# EasyEDA schematic 9833YUANLI.json
REV: 1.0; Sheet: 1/1
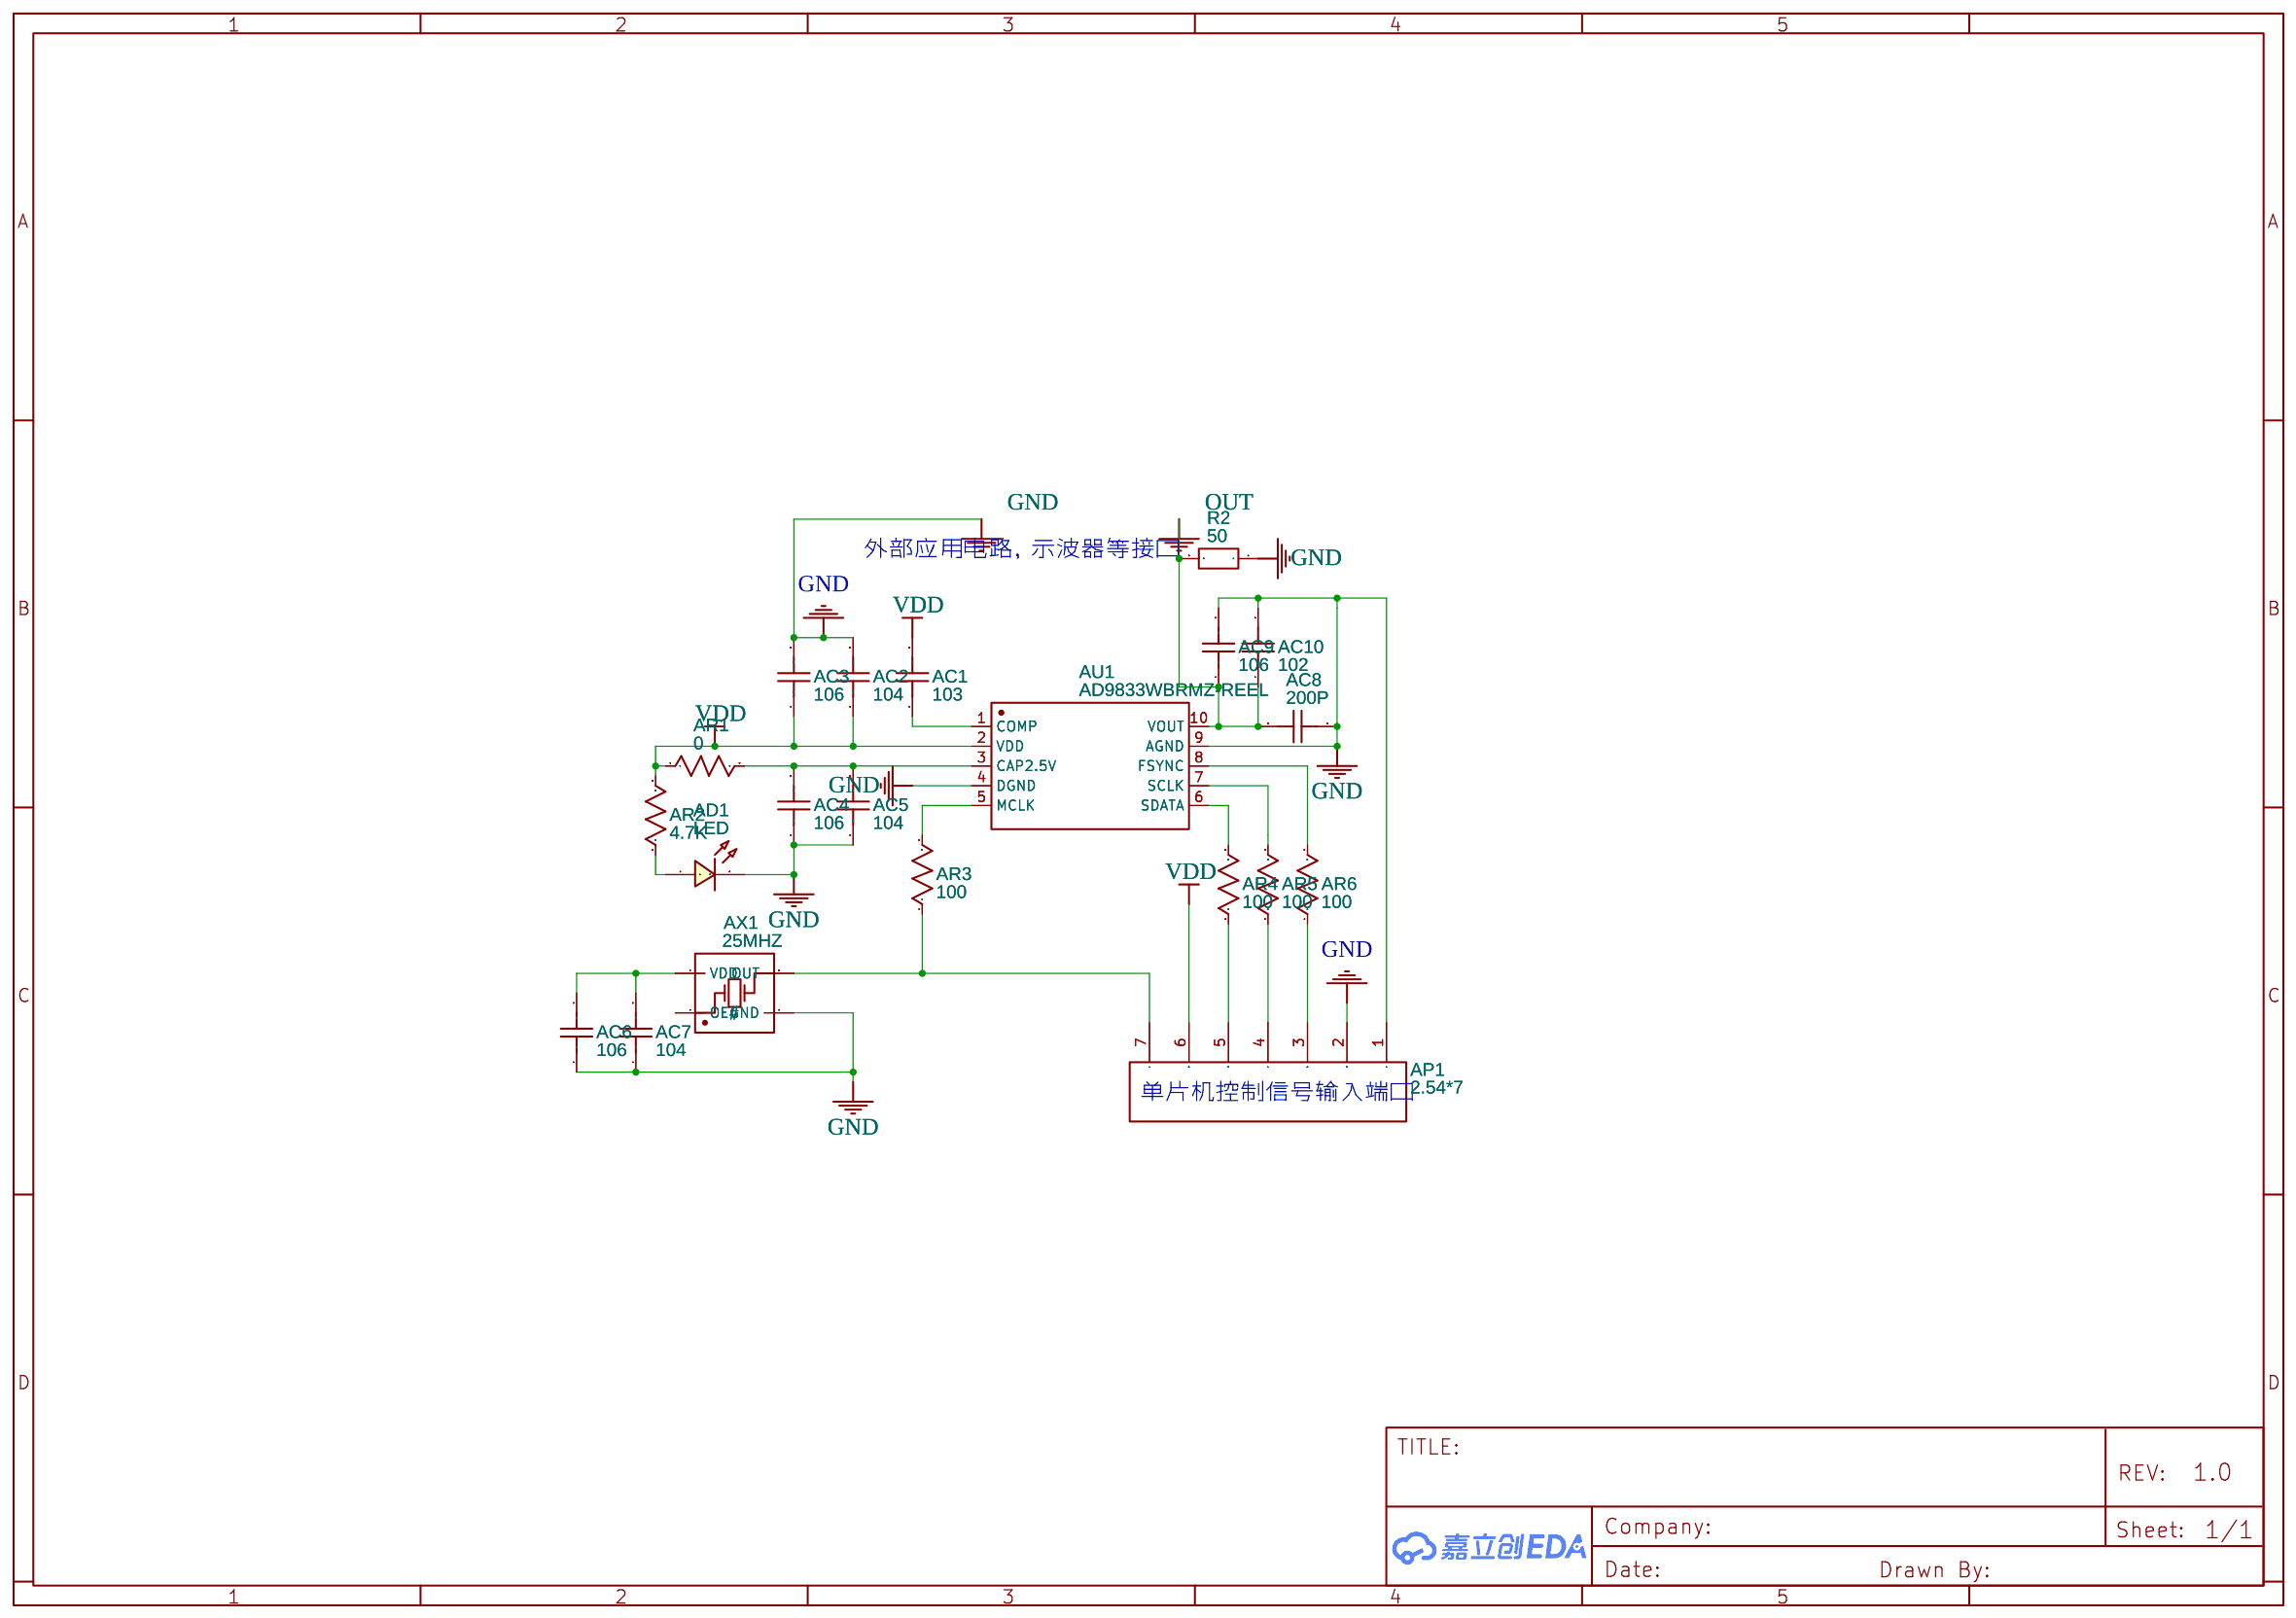
[diagram p0: schematic sheet]

## Parts
AC1  103  [C0603]
AC2  104  [C0603]
AC3  106  [C0603]
AC4  106  [C0603]
AC5  104  [C0603]
AC6  106  [C0603]
AC7  104  [C0603]
AC8  200P  [C0603]
AC9  106  [C0603]
AC10  102  [C0603]
AD1  LED  [LED0805_RED]
AP1  2.54*7
AR1  0  [R0603]
AR2  4.7K  [R0603]
AR3  100  [R0603]
AR4  100  [R0603]
AR5  100  [R0603]
AR6  100  [R0603]
AU1  AD9833WBRMZ-REEL  [MSOP-10]
AX1  25MHZ  [OSC-S3225_4P]
R2  50  [R0603]

## Library data of the parts
AC1-AC10 = C_0603_US: Contributor: LCEDA_Lib
AD1 = LED-0805_R: Manufacturer: EVERLIGHT(台湾亿光); Manufacturer Part: 17-21SURC/S530-A3/TR8; Supplier Part: C72037; Contributor: LCEDA_Lib
AP1 = 2.54*7: Contributor: MR_Peng888
AR1-AR6 = R_0603_US: Contributor: LCEDA_Lib
AU1 = AD9833WBRMZ-REEL
AX1 = HSO321S 25MHZ 3.3V: Supplier: LCSC; Supplier Part: C160454; Manufacturer: Harmony Elec; Contributor: hooray
R2 = R_0603_EU: Contributor: LCEDA_Lib

## Nets
GND: AC2.2 AC3.2 AC4.1 AC5.1 AC6.1 AC7.1 AC8.1 AC9.2 AC10.2 AD1.2 AP1.1 AP1.2 AU1.4(DGND) AU1.9(AGND) AX1.2(GND) R2.1
VDD: AC1.2 AC2.1 AC3.1 AP1.6 AR1.1 AR2.2 AU1.2(VDD)
OUT: AC8.2 AC9.1 AC10.1 AU1.10(VOUT) R2.2
Net-(AC1-1): AC1.1 AU1.1(COMP)
Net-(AC4-2): AC4.2 AC5.2 AR1.2 AU1.3(CAP2.5V)
Net-(AC6-2): AC6.2 AC7.2 AX1.4(VDD)
Net-(AD1-1): AD1.1 AR2.1
Net-(AP1-3): AP1.3 AR6.1
Net-(AP1-4): AP1.4 AR5.1
Net-(AP1-5): AP1.5 AR4.1
Net-(AP1-7): AP1.7 AR3.1 AX1.3(OUT)
Net-(AR3-2): AR3.2 AU1.5(MCLK)
Net-(AR4-2): AR4.2 AU1.6(SDATA)
Net-(AR5-2): AR5.2 AU1.7(SCLK)
Net-(AR6-2): AR6.2 AU1.8(FSYNC)

Not connected (* = marked no-connect by the designer): AX1 1(OE#)

## Notes on the sheet
- 外部应用电路，示波器等接口
- 单片机控制信号输入端口
